# EAGLE board SCK_DATA_BOARD_2.2 (EAGLE 9.6.2)
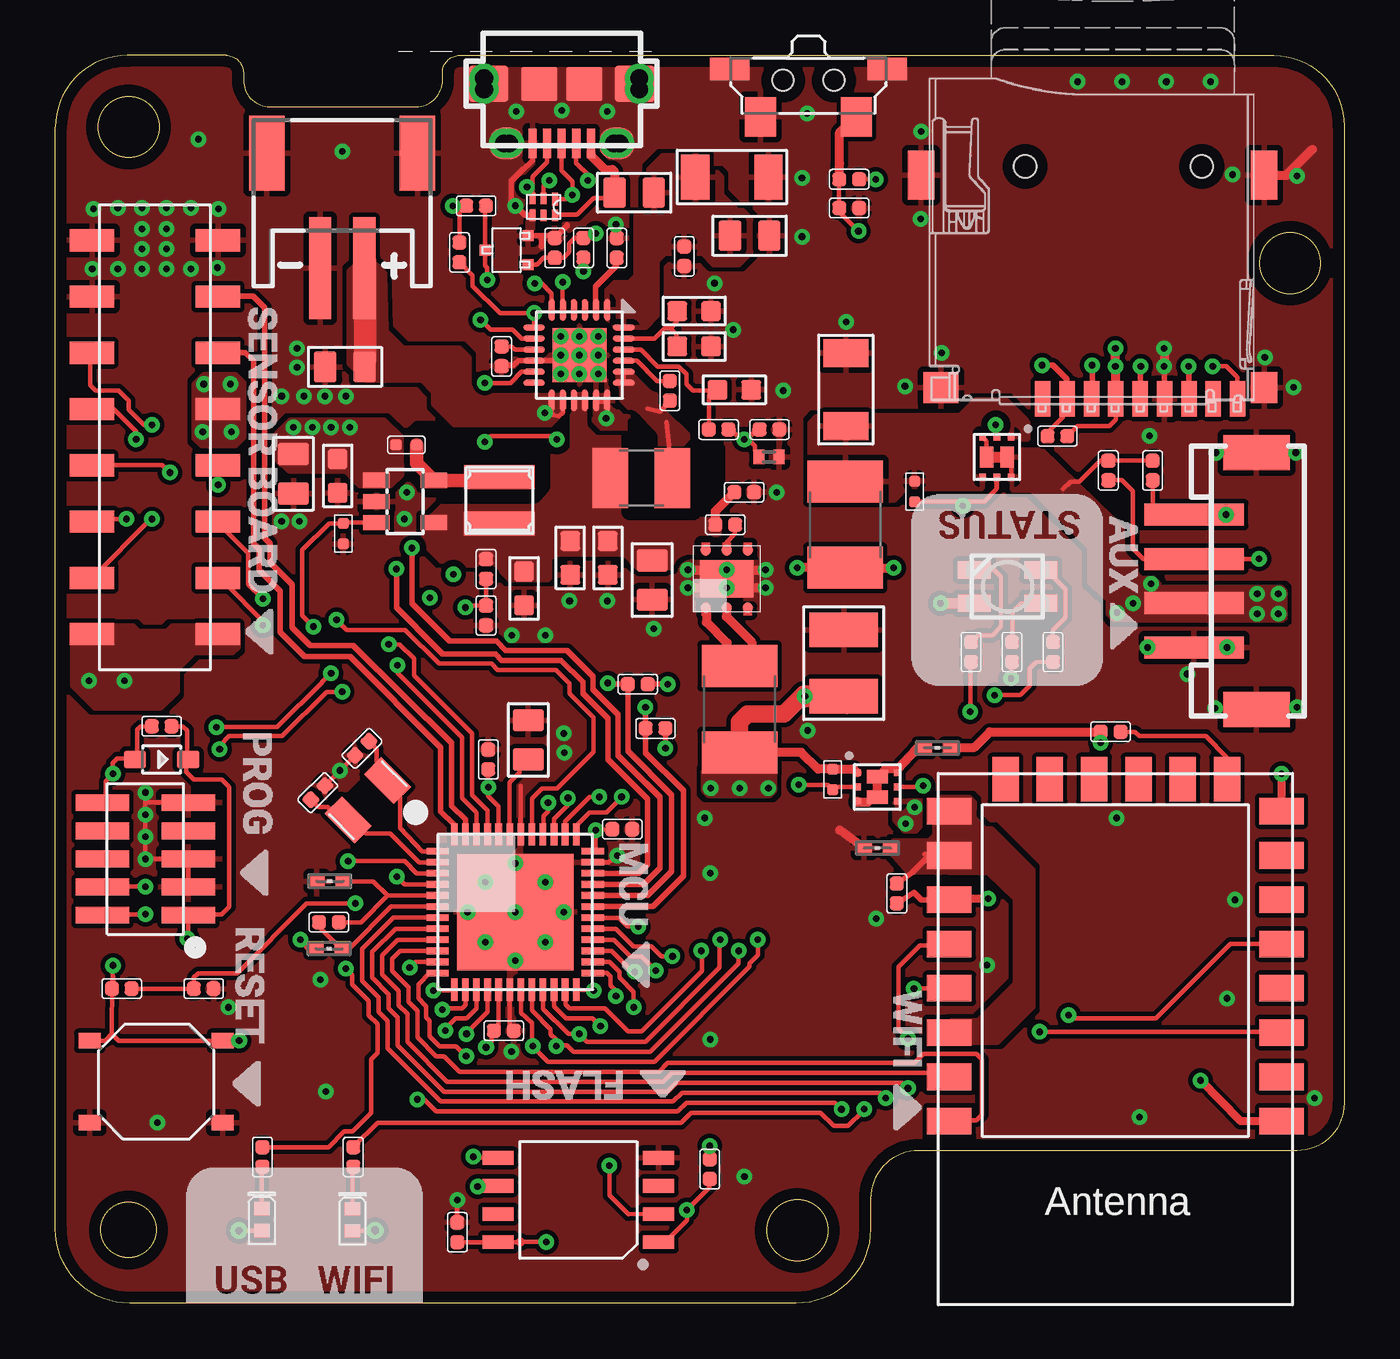
[diagram p3: board, top side]
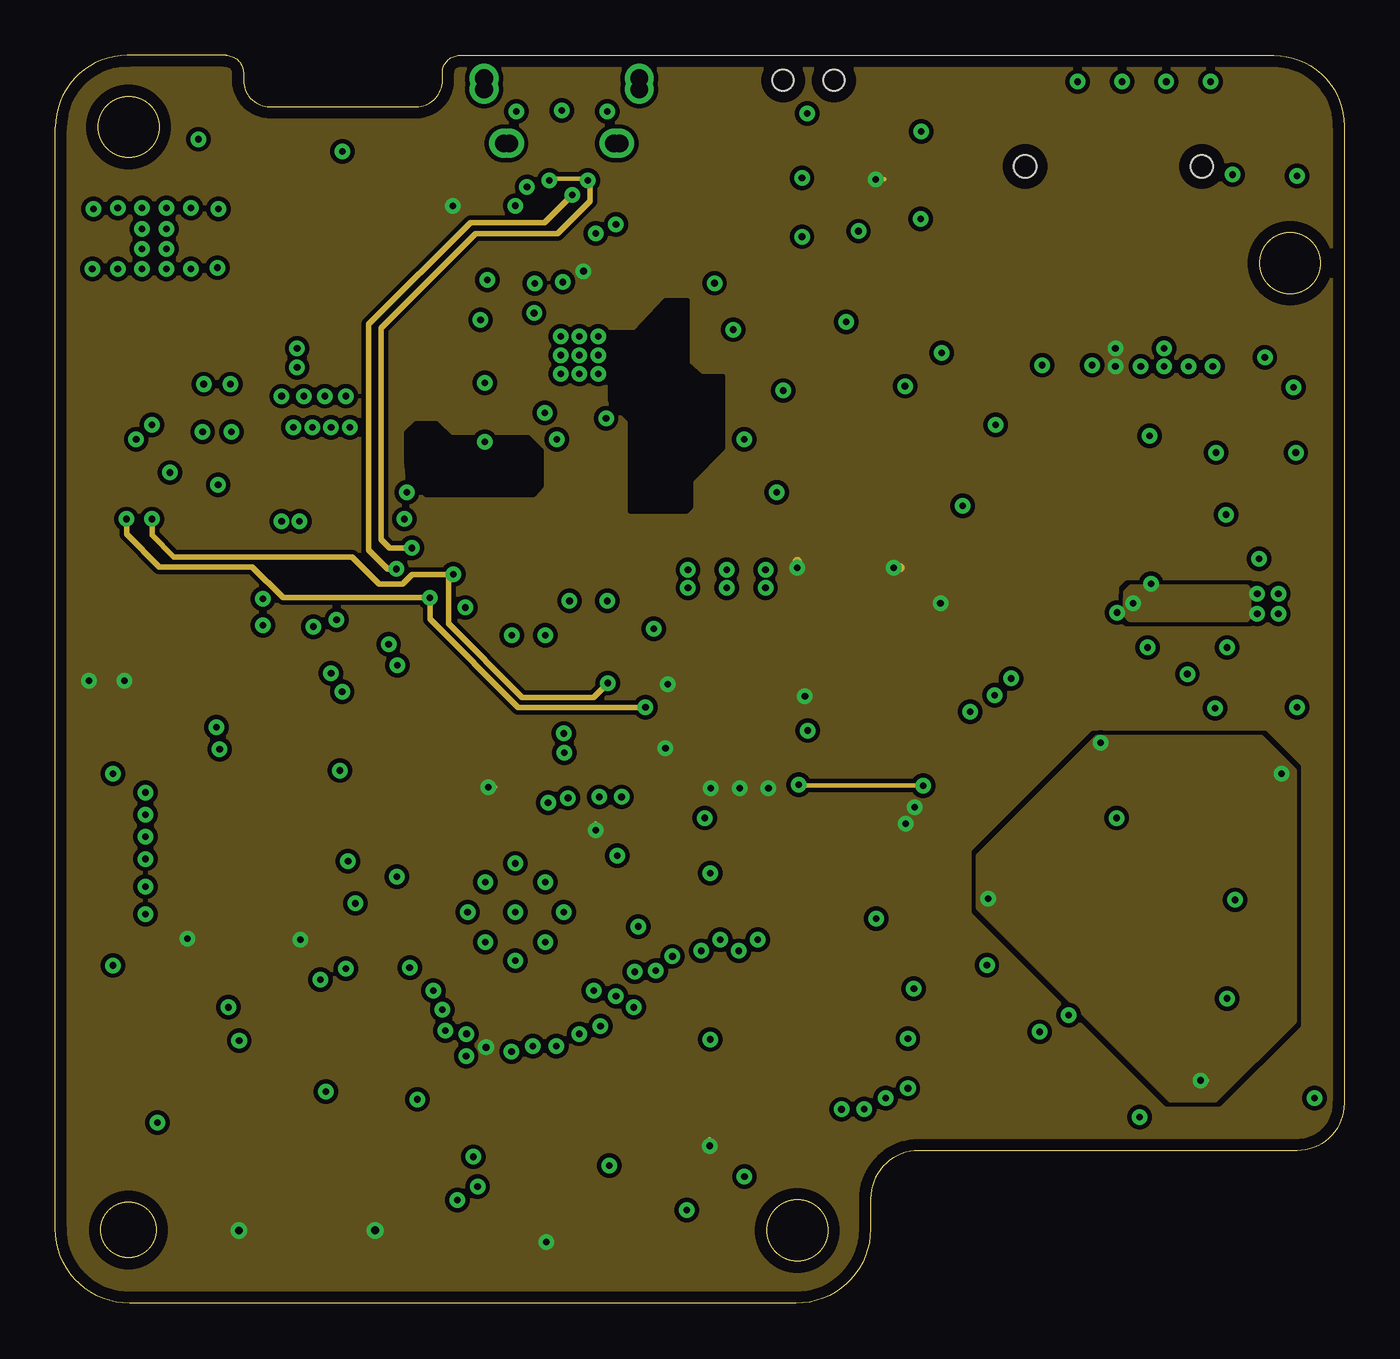
[diagram p4: board, inner layer VCC]
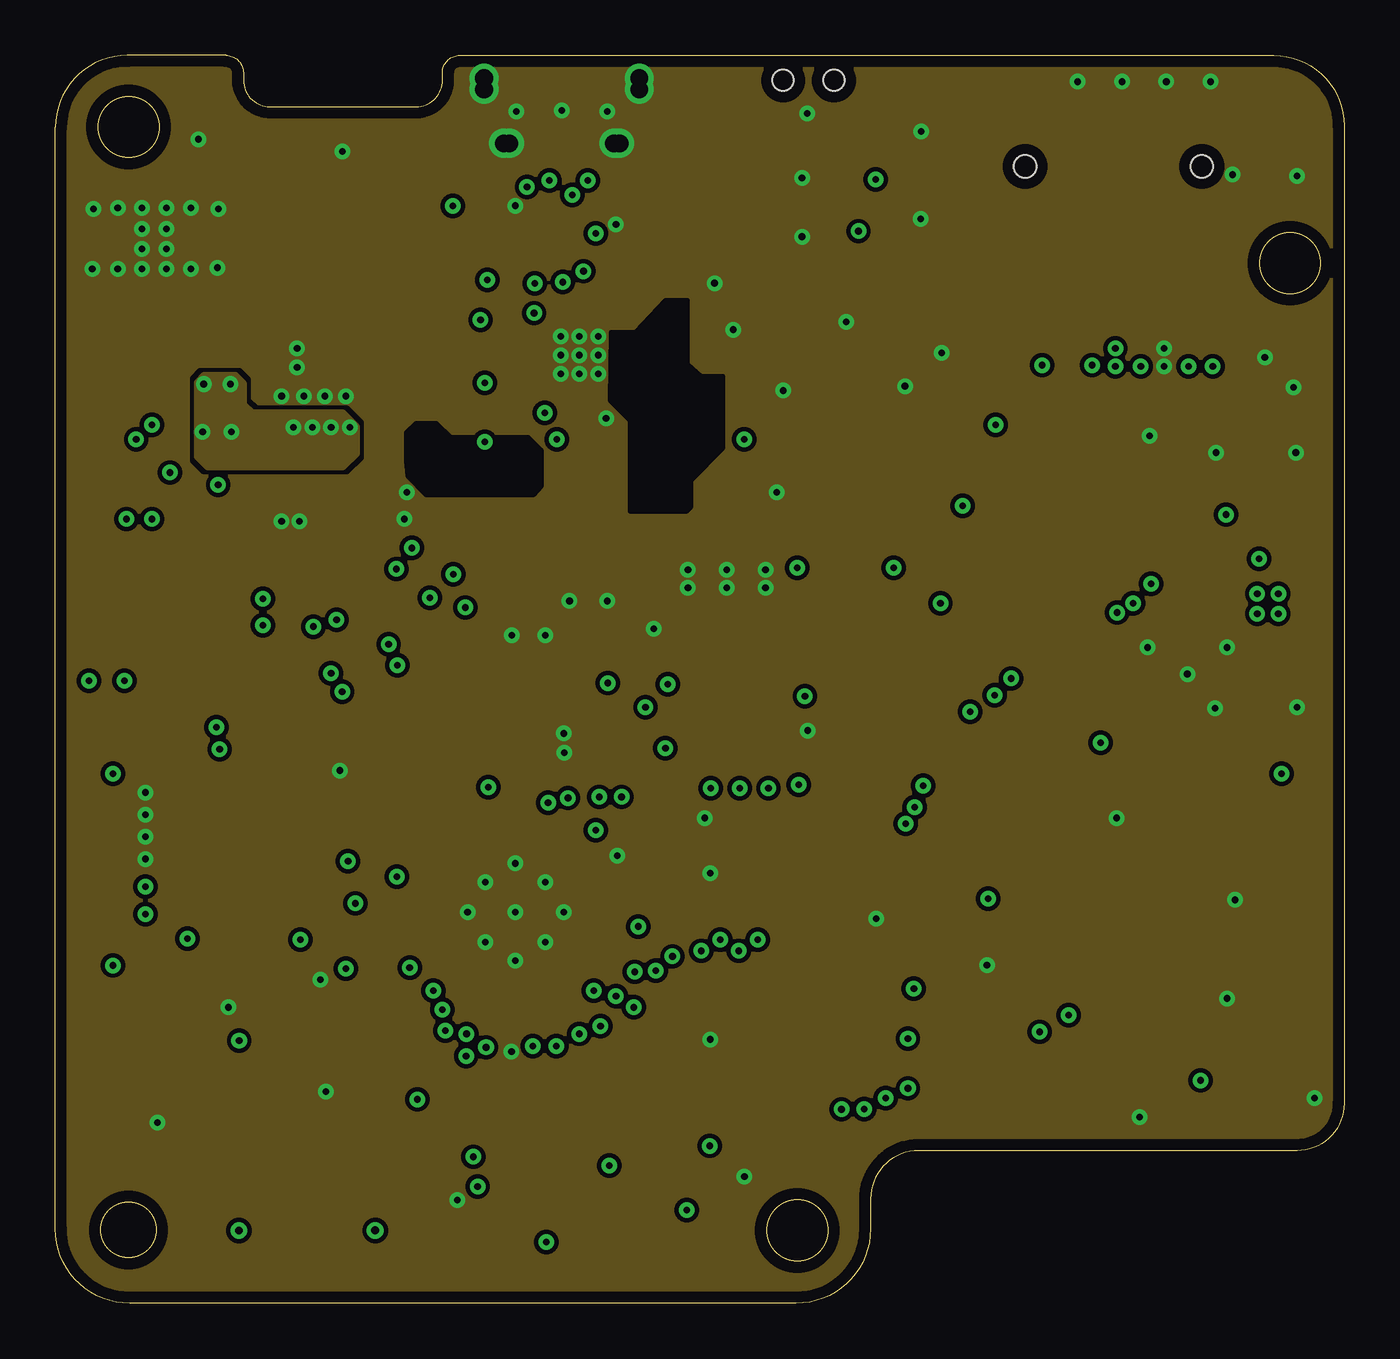
[diagram p5: board, inner layer GND]
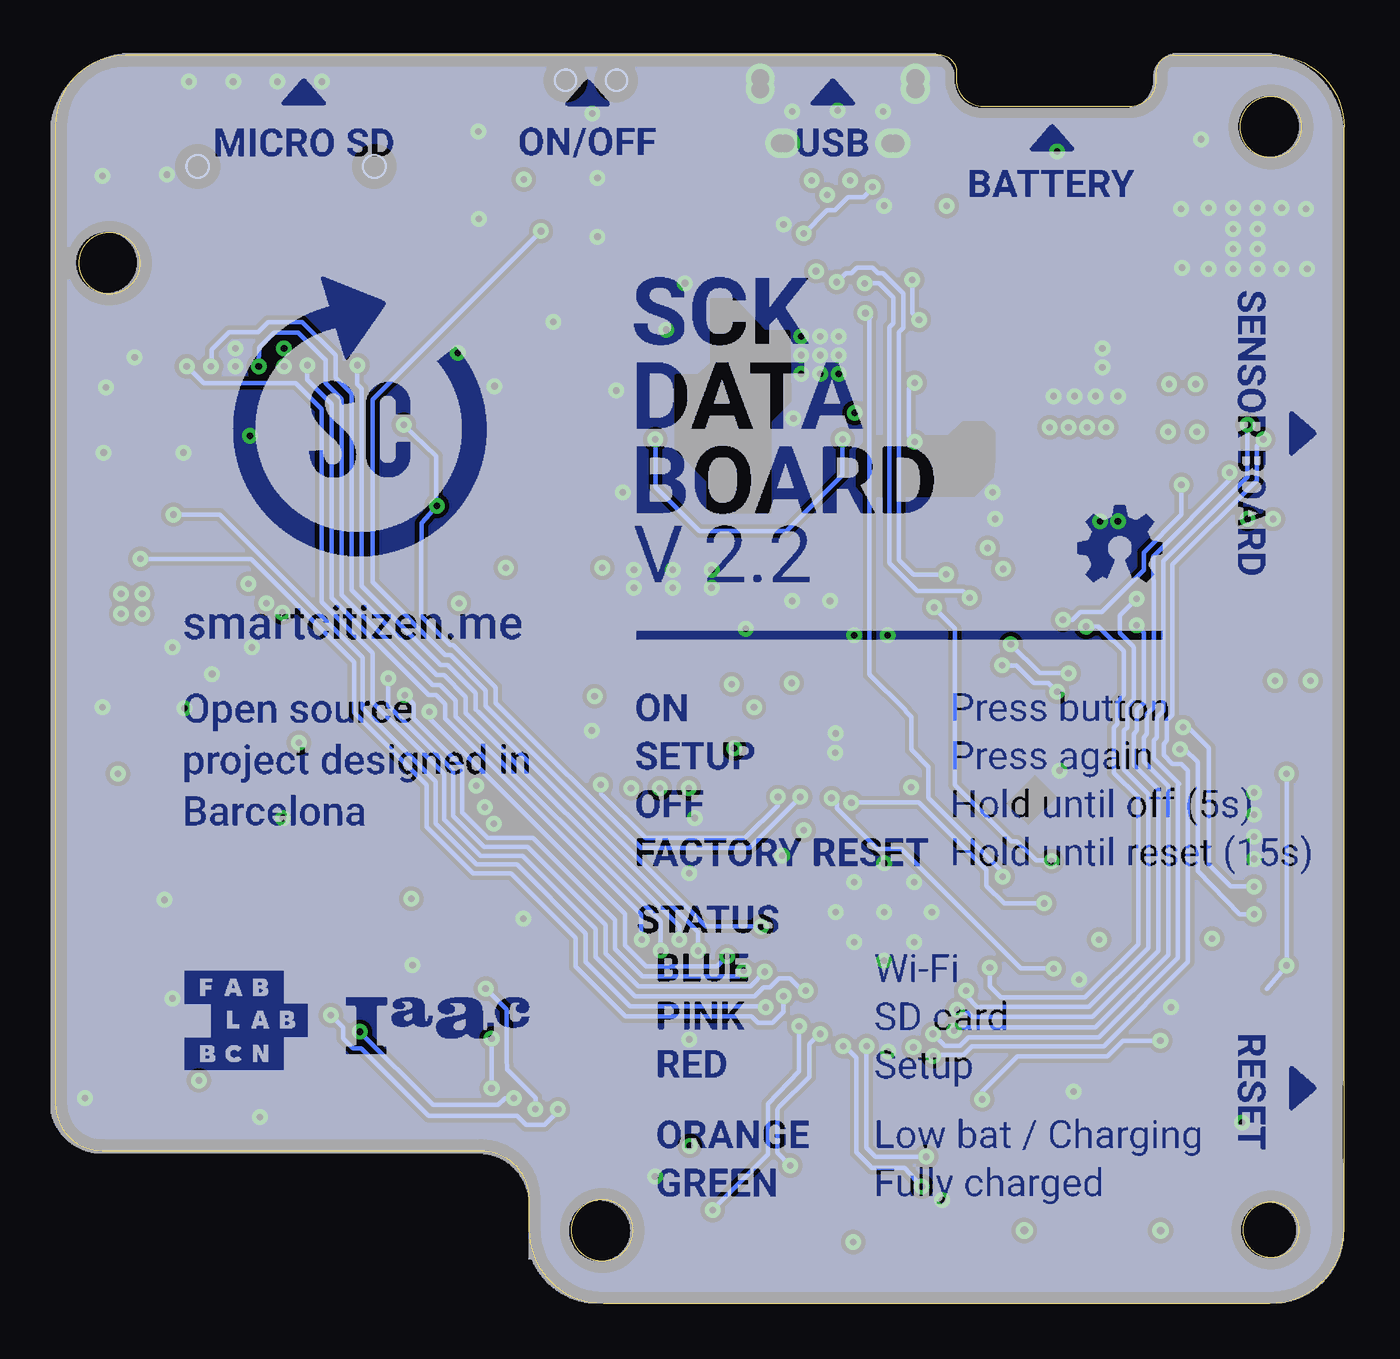
[diagram p6: board, bottom side, seen from below]

Size 58.2 x 56.36 mm. Coordinates in mm from the lower left corner, seen from the top.
Outline: 8.49,55.57 8.49,55.23 arc90 9.68,54.04 16.3,54.04 arc90 17.48,55.22 17.48,55.58 arc-90 18.26,56.36 55.03,56.36 arc-90 58.2,53.19 58.2,9.02 arc-90 56.07,6.89 38.99,6.89 arc90 36.81,4.72 36.81,3.36 arc-90 33.45,0 3.36,0 arc-90 0,3.36 0,53.1 arc-90 3.25,56.36 7.71,56.36 arc-90 8.49,55.57
Outline: circle at 33.5,3.29 radius 1.38
Outline: circle at 55.76,46.98 radius 1.38
Outline: circle at 3.3,53.12 radius 1.38
Outline: circle at 3.3,3.31 radius 1.25
Copper layers (1*2*3*16): Top 0.035mm / dielectric 0.2mm / VCC 0.035mm / dielectric 0.2mm / GND 0.035mm / dielectric 0.2mm / Bottom 0.035mm
Design rules "default *": minimum track width 0.2mm, minimum drill 0.3mm, track to track 0.2mm, track to pad 0.2mm, pad to pad 0.2mm, via to via 0.2mm, smd to smd 0mil, copper to edge 20mil, drill to drill 0.5mm, minimum pad ring 10mil, minimum via ring 0.2mm, stop-mask expansion 0.05mm, vias tented up to drill 24mil, thermal gap 10mil
Net classes: 2 gnd: width 0.254 mm, drill 0.254 mm, clearance 0.178 mm; 3 usbvcc: width 0.203 mm, drill 0.406 mm, clearance 0.178 mm; 4 USBpair: width 0.254 mm, drill 0.406 mm, clearance 0.406 mm
tRestrict: area 15.8,36.5 to 21.9,39.8; area 25.9,35.8 to 30.1,39.9
bRestrict: area 15.8,36.5 to 21.9,39.8; area 25.1,35.8 to 30.1,45.3

## Footprints (pad centres in the part's own frame; a part is rotated, then mirrored left to right if it is on the bottom)
JSTPH2_BATT = smd 1 x 4.6: 1 -1,-3.7; 2 1,-3.7 | smd 1.6 x 3.4: NC1 -3.4,1.5; NC2 3.4,1.5
C0402 = smd 0.635 x 0.635: 1 0,0.445; 2 0,-0.445
C1206 = smd 1.27 x 2.032: 1 -1.651,0; 2 1.651,0
C0805 = smd 1.397 x 1.016: 1 0,0.889; 2 0,-0.889
C1210 = smd 1.55 x 3.1: 1 -1.5,0; 2 1.5,0
C0603 = smd 0.889 x 0.889: 1 0,0.762; 2 0,-0.762
C0402' = smd 0.5 x 0.5: 1 0,0.463; 2 0,-0.463
PINHD_2X8_SMD_FEMALE_UNHOLED = smd 1 x 2: 1 -8.89,-2.84; 2 -8.89,2.845; 3 -6.35,-2.845; 4 -6.35,2.845; 5 -3.81,-2.84; 6 -3.81,2.85; 7 -1.27,-2.845; 8 -1.27,2.845; 9 1.27,-2.845; 10 1.275,2.845; 11 3.81,-2.84; 12 3.81,2.845; 13 6.35,-2.84; 14 6.35,2.845; 15 8.89,-2.845; 16 8.89,2.845
SOD-323 = smd 1 x 0.8: + -1.2,0; - 1.2,0
L1812 = smd 1.9 x 3.4: 1 -1.95,0; 2 1.95,0
SOT-23-5 = smd 0.69 x 1.2: 1 -0.95,-1.3; 2 0,-1.3; 3 0.95,-1.3; 4 0.95,1.3; 5 -0.95,1.3
24-PIN_VQFN_THPAD = smd 1 x 0.28: 1 -2.05,1.25; 2 -2.05,0.75; 3 -2.05,0.25; 4 -2.05,-0.25; 5 -2.05,-0.75; 6 -2.05,-1.25; 13 2.05,-1.25; 14 2.05,-0.75; 15 2.05,-0.25; 16 2.05,0.25; 17 2.05,0.75; 18 2.05,1.25 | smd 0.28 x 1: 7 -1.25,-2.05; 8 -0.75,-2.05; 9 -0.25,-2.05; 10 0.25,-2.05; 11 0.75,-2.05; 12 1.25,-2.05; 19 1.25,2; 20 0.75,2; 21 0.25,2; 22 -0.25,2; 23 -0.75,2; 24 -1.25,2 | smd 2.45 x 2.45: 25 0,0
DFN6_3X3MM = smd 0.45 x 0.5: 1 -0.95,-1.3; 2 0,-1.3; 3 0.95,-1.3; 4 0.95,1.3; 5 0,1.3; 6 -0.95,1.3 | smd 2.45 x 1.7: 7 0,0
HANGAR_ESP12-E = smd 2 x 1.2: 1 0.5,15.74; 2 0.5,13.74; 3 0.5,11.74; 4 0.5,9.74; 5 0.5,7.74; 6 0.5,5.74; 7 0.5,3.74; 8 0.5,1.74; 15 15.5,1.74; 16 15.5,3.74; 17 15.5,5.74; 18 15.5,7.74; 19 15.5,9.74; 20 15.5,11.74; 21 15.5,13.74; 22 15.5,15.74 | smd 1.2 x 2: 9 2.96,0.3; 10 4.96,0.3; 11 6.96,0.3; 12 8.96,0.3; 13 10.96,0.3; 14 12.96,0.3
QFN48-7X7 = smd 1 x 0.3: 1 -3.5,2.75; 2 -3.5,2.25; 3 -3.5,1.75; 4 -3.5,1.25; 5 -3.5,0.75; 6 -3.5,0.25; 7 -3.5,-0.25; 8 -3.5,-0.75; 9 -3.5,-1.25; 10 -3.5,-1.75; 11 -3.5,-2.25; 12 -3.5,-2.75; 25 3.5,-2.75; 26 3.5,-2.25; 27 3.5,-1.75; 28 3.5,-1.25; 29 3.5,-0.75; 30 3.5,-0.25; 31 3.5,0.25; 32 3.5,0.75; 33 3.5,1.25; 34 3.5,1.75; 35 3.5,2.25; 36 3.5,2.75 | smd 0.3 x 1: 13 -2.75,-3.5; 14 -2.25,-3.5; 15 -1.75,-3.5; 16 -1.25,-3.5; 17 -0.75,-3.5; 18 -0.25,-3.5; 19 0.25,-3.5; 20 0.75,-3.5; 21 1.25,-3.5; 22 1.75,-3.5; 23 2.25,-3.5; 24 2.75,-3.5; 37 2.75,3.5; 38 2.25,3.5; 39 1.75,3.5; 40 1.25,3.5; 41 0.75,3.5; 42 0.25,3.5; 43 -0.25,3.5; 44 -0.75,3.5; 45 -1.25,3.5; 46 -1.75,3.5; 47 -2.25,3.5; 48 -2.75,3.5 | smd 5.25 x 5.25: TP 0,0
SOIC_8-208MILS = smd 0.62 x 1.4: 1 -1.905,-3.823; 2 -0.635,-3.823; 3 0.635,-3.823; 4 1.905,-3.823; 5 1.905,3.423; 6 0.635,3.423; 7 -0.635,3.423; 8 -1.905,3.423
L0805 = smd 1.016 x 1.397: 1 -0.889,0; 2 0.889,0
HANGAR_C1210 = smd 1.6 x 2.7: 1 -1.4,0; 2 1.4,0
0402 = smd 0.7 x 0.6: 1 -0.6,0; 2 0.6,0
IND_BOURNS_SRN3015TA_3X3_SMD = smd 1.1 x 3.2: P$1 -1.05,0; P$2 1.05,0
HANGAR_P-LCC-4 = smd 0.8 x 1.5: 1 -0.75,-1.5; 2 -0.75,1.5; 3 0.75,1.5; 4 0.75,-1.5
CHIPLED_0402_YELLOW = smd 0.6 x 0.7: A 0.5,0; K -0.5,0
CHIPLED_0402_BLUE = smd 0.6 x 0.7: A 0.5,0; K -0.5,0
SW4-SMD-7.0X3.5X3.5MM-90D = smd 1.397 x 1.778: 1 -2.159,1.651; 2 2.159,1.651 | smd 1.778 x 1.016: S1 -3.556,-0.508; S2 3.556,-0.508 | hole 0.95: -1.15,0; 1.15,0
SW4-SMD-5.2X5.2X1.5MM = smd 1 x 0.7: 1 -3,1.85; 2 3,1.85; 3 -3,-1.85; 4 3,-1.85
POWERPAK-SC70-6L = smd 0.3 x 0.325: 1 -0.65,-0.912; 2 0,-0.912; 3 0.65,-0.912; 4 0.65,0.912; 5 0,0.912; 6 -0.65,0.912 | smd 0.613 x 0.95: TP1 -0.467,0; TP2 0.467,0
NMOS_UMT3 = smd 0.5 x 0.5: 1 0.65,-2.05; 2 -0.65,-2.05; 3 0,-0.1
HANGAR_R0402 = smd 0.5 x 0.65: 1 -0.45,0; 2 0.45,0
R0402 = smd 0.635 x 0.635: 1 0,0.445; 2 0,-0.445
R0402' = smd 0.5 x 0.5: 1 0,0.463; 2 0,-0.463
TF-01 = smd 0.7 x 1.6: 1 2.25,10.5; 2 1.15,10.5; 3 0.05,10.5; 4 -1.05,10.5; 5 -2.15,10.5; 6 -3.25,10.5; 7 -4.35,10.5; 8 -5.45,10.5; CD -6.55,10.5 | smd 1.2 x 1.4: 9 -7.75,10 | smd 1.2 x 2.2: 10 -7.75,0.4; 11 7.75,0.4 | smd 1.6 x 1.4: 12 6.85,10 | hole 1: -4.93,0; 3.05,0
2X05_SMD_1.27MM = smd 0.76 x 2.4: 1 -2.54,-1.94; 2 -2.54,1.94; 3 -1.27,-1.94; 4 -1.27,1.94; 5 0,-1.94; 6 0,1.94; 7 1.27,-1.94; 8 1.27,1.94; 9 2.54,-1.94; 10 2.54,1.94
DRY6 = smd 0.559 x 0.305: 1 -0.356,0.508 | smd 0.508 x 0.305: 2 -0.381,0; 3 -0.381,-0.508; 4 0.381,-0.508; 5 0.381,0; 6 0.381,0.508
CON2_USB_MICRO_B_AT = smd 0.406 x 1.346: D+ 0,2.692; D- -0.66,2.692; GND 1.321,2.692; ID 0.66,2.692; VBUS -1.321,2.692 | drill 0.8 pad 1.27: P$1 -2.616,2.692 | drill 0.8 pad 1.245: P$2 -2.362,2.692; P$7 2.362,2.692; P$8 2.616,2.692 | drill 0.8 pad 1.143: P$3 -3.505,-0.254; P$4 -3.505,0.254; P$5 3.505,0.254; P$6 3.505,-0.254 | smd 1.778 x 1.651: S1 -3.302,0; S2 3.302,0 | smd 1.524 x 1.41: S3 -2.489,2.692; S4 2.489,2.692 | smd 1.626 x 1.524: S5 -1.016,0; S6 1.016,0
CONNECTOR-NEW_HW4-SMD-2.0 = smd 1 x 4.5: 1 -3,0.3; 2 -1,0.3; 3 1,0.3; 4 3,0.3 | smd 1.6 x 3: SS1 -5.8,3.123; SS2 5.8,3.123
CRISTALLI_RESONATOR_EPSON_FC_145 = smd 1.1 x 1.9: P$1 -1.25,0; P$2 1.25,0

## Placement (x,y rotation side)
BAT  JST_PH_2PIN_MT_BATT  [JSTPH2_BATT]  12.95,50.44 0 top
C1  100nf  [C0402]  38,18.51 0 top
C2  100nf  [C0402]  18.15,3.21 0 top
C3  10nf  [C0402]  6.7,14.21 270 top
C4  100nf  [C0402]  28.4,47.28 180 top
C5  10uf  [C1206]  30.55,50.86 180 top
C6  1uf  [C0805]  31.35,48.21 270 top
C7  47uf  [C0805]  10.75,37.46 180 top
C8  10uf  [C1206]  35.7,41.26 270 top
C9  47uf  [C1210]  35.6,28.91 270 top
C10  100nf  [C0402]  31.1,36.63 270 top
C11  1uf  [C0805]  26.95,32.66 180 top
C12  4.7uf  [C0603]  28.85,44.81 270 top
C13  4.7uf  [C0603]  28.85,43.21 270 top
C14  47nf  [C0402]  27.75,41.21 0 top
C15  10uf  [C0603]  23.25,33.66 180 top
C16  10uf  [C0603]  24.95,33.66 180 top
C17  4.7uf  [C0603]  30.66,41.25 270 top
C18  4.7uf  [C0603]  21.17,32.28 180 top
C19  22pf  [C0402]  13.85,25.06 135 top
C20  22pf  [C0402]  11.85,23.06 315 top
C21  2.2nf  [C0402']  15.85,38.76 90 top
C22  100nf  [C0402]  12.35,17.21 270 top
C23  100nf  [C0402]  20.25,12.31 270 top
C24  100nf  [C0402]  19.55,24.56 0 top
C25  100nf  [C0402]  25.6,21.41 270 top
C26  1uf  [C0805]  21.36,25.44 0 top
C27  10uf  [C0603]  12.75,37.36 180 top
C28  1uf  [C0805]  13.08,42.29 90 top
C29  100nf  [C0402]  35.85,49.46 270 top
CONN_DATA  [PINHD_2X8_SMD_FEMALE_UNHOLED]  4.5,39.11 90 top
D1  30V-0.5A  [SOD-323]  4.8,24.56 0 top
F1  MF-MSMF075-2 750mA  [L1812]  35.67,35.17 270 top
F2  MF-MSMF150/12 1500mA  [L1812]  30.9,26.83 90 top
IC1  ETA1036-50S2F-T-SOT23-5  [SOT-23-5]  15.8,36.21 270 top
IC2  BQ24259_VQFN(24)  [24-PIN_VQFN_THPAD]  23.67,42.82 270 top
IC3  LD39200  [DFN6_3X3MM]  30.32,32.72 0 top
IC4  HANGAR_ESP-12-E  [HANGAR_ESP12-E]  55.87,23.97 180 top
IC5  SAMD21G18A-MUT  [QFN48-7X7]  20.77,17.67 0 top
IC6  S25FL064L  [SOIC_8-208MILS]  23.42,4.67 90 top
L1  470R-2A  [L0805]  26.14,50.16 0 top
L2  1uH  [HANGAR_C1210]  26.47,37.27 180 top
L3  MPZ1005S121C  [0402]  39.83,25.08 180 top
L4  MPZ1005S121C  [0402]  37.12,20.56 180 top
L5  MPZ1005S121C  [0402]  12.36,16.02 0 top
L6  MPZ1005S121C  [0402]  12.4,19.06 0 top
L7  6.8uH  [IND_BOURNS_SRN3015TA_3X3_SMD]  20.05,36.26 90 top
LED1  LED_RGB_CAASMB-MTB1-0A3A  [HANGAR_P-LCC-4]  43,32.36 270 top
LED2  YELLOW-0402  [CHIPLED_0402_YELLOW]  9.33,3.78 270 top
LED3  BLUE-0402  [CHIPLED_0402_BLUE]  13.42,3.77 270 top
P1  TS-1188E  [SW4-SMD-7.0X3.5X3.5MM-90D]  34.01,55.23 180 top
P2  SKQGADE010  [SW4-SMD-5.2X5.2X1.5MM]  4.55,10.01 0 top
Q1  PMOS  [POWERPAK-SC70-6L]  37.12,23.32 270 top
Q2  NMOS  [NMOS_UMT3]  19.3,47.56 90 top
Q3  PMOS  [POWERPAK-SC70-6L]  42.52,38.22 180 top
R1  No BOM  [HANGAR_R0402]  32.22,38.22 180 top
R2  10K 1/16W  [R0402]  19.45,33.16 180 top
R3  10K 1/16W  [R0402]  47.65,25.81 270 top
R4  1K  [R0402]  13.45,6.61 0 top
R5  10K 1/16W  [R0402]  30.25,35.16 90 top
R6  100K 1/16W  [R0402]  25.35,47.66 0 top
R7  100K 1/16W  [R0402]  22.55,47.66 0 top
R8  100K 1/16W  [R0402]  19,49.56 270 top
R9  100K 1/16W  [R0402]  20.15,42.76 180 top
R10  47K  [R0402]  29.95,39.46 270 top
R11  68K  [R0402]  32.25,39.46 270 top
R12  10K 1/16W  [R0402]  19.45,31.06 180 top
R13  10K 1/16W  [R0402]  27.1,25.96 90 top
R14  10K 1/16W  [R0402]  26.3,27.96 90 top
R15  330R  [R0402]  3,14.21 270 top
R16  10K 1/16W  [R0402]  4.8,26.06 90 top
R17  10K 1/16W  [R0402]  35.85,50.76 90 top
R18  1K  [R0402]  9.35,6.61 0 top
R19  1K  [R0402]  41.35,29.41 180 top
R20  1K  [R0402]  45.05,29.41 180 top
R21  1K  [R0402]  43.2,29.41 180 top
R22  10K 1/16W  [R0402]  49.55,37.61 180 top
R23  10K 1/16W  [R0402]  47.55,37.61 180 top
R24  10K 1/16W  [R0402]  29.55,6.06 180 top
R25  10K 1/16W  [R0402]  45.25,39.16 90 top
R26  10K 1/16W  [R0402]  23.85,47.66 0 top
R27  10K 1/16W  [R0402']  13,34.76 180 top
R28  10K 1/16W  [R0402']  35.1,23.66 180 top
R29  10K 1/16W  [R0402']  38.8,36.66 0 top
R30  10K 1/16W  [R0402]  18.25,47.46 180 top
SD1  SD_CARD_SOCKETTF-01  [TF-01]  46.84,51.34 180 top
SWD  20021121-00010C4LF  [2X05_SMD_1.27MM]  4.07,20.07 90 top
TVS1  TPD4S012_DRY_6  [DRY6]  22.05,49.51 270 top
USB  10118193-0001LF  [CON2_USB_MICRO_B_AT]  22.86,55.07 180 top
X1  1125S-SMT-4P  [CONNECTOR-NEW_HW4-SMD-2.0]  51.12,32.62 270 top
Y1  32,768Khz_SMD  [CRISTALLI_RESONATOR_EPSON_FC_145]  14.11,22.72 45 top

## Tracks (layer width: path | path; a pad name or v marks a point on that pad's centre or on a via)
!INT_CCS  (via drill 0.3)
  Top 0.2: IC5.13 17.8,14.14 17.09,14.14 v17.07,14.12 | 9.37,31.87 v9.37,31.82 8.72,32.47 8.72,33.88 7.34,35.26 CONN_DATA.5
  Bottom 0.2: v9.37,31.82 10.12,31.07 10.12,30.27 9.52,29.67 9.52,29.63 9.5,29.61 9.5,27.26 9.8,26.96 9.8,26.01 9.95,25.86 9.95,24.11 8.85,23.01 8.85,16.06 11.53,13.38 13.13,13.38 16.42,13.38 16.56,13.37 17.07,13.88 v17.07,14.12
!WAKE_CCS  (via drill 0.3)
  Top 0.2: CONN_DATA.7 v7.34,36.97 v7.35,36.96 | 21.55,21.2 IC5.41 21.52,22.8 21.98,23.26 22.65,23.26 24.29,24.9 24.29,26.46 23.22,27.53 23.22,27.99 22.6,28.61 19.97,28.61 19.69,28.89 17.32,28.89 15.79,30.41 15.19,30.41
  Top 0.203: v12.7,30.86 13.15,30.41 15.19,30.41 15.47,30.41
  Bottom 0.2: v7.35,36.96 7.35,35.61 9.05,33.91 9.05,33.11 10.15,32.01
  Bottom 0.203: v12.7,30.86 12.27,30.86 11.92,31.21 10.95,31.21 10.15,32.01
+5V  (via drill 0.3)
  Top 0.5: CONN_DATA.9
  other vias: 10.75,39.56 11.6,39.56 12.45,39.56 13.3,39.56 6.65,39.36 7.95,39.36 6.7,41.51 7.9,41.51
  pour Top (no thermals): 10.2,37.86 9.9,38.16 9.9,39.21 10.6,39.91 14.85,39.91 15.65,39.11 15.65,37.41 15.15,36.91 13.75,36.91 13.1,37.56 10.55,37.56 10.35,37.76
  pour GND: 6.35,41.61 6.7,41.96 8.15,41.96 8.55,41.56 8.55,40.61 8.9,40.26 13,40.26 13.65,39.61 13.65,38.36 13,37.71 6.85,37.71 6.35,38.21
  pour Top (no thermals): 6.3,41.56 6.7,41.96 8.15,41.96 8.55,41.56 8.55,39.36 8.55,39.11 8.15,38.71 6.6,38.71 6.25,39.06 6.25,41.51
AGND
  Top 0.2: 15,18.41 13.8,17.21 C22.1 | 15,18.41 IC5.5 | L6.2 14.35,19.06 15,18.41
  Top 0.25: IC5.5
AVCC
  Top 0.2: IC5.6 15.17,17.92 13.27,16.02 L5.2 12.89,16.02 11.95,16.96 11.95,17.27 C22.2
BTST
  Top 0.2: IC2.21 26.27,42.57 27.18,41.66 C14.1
CD_MMC  (via drill 0.3)
  Top 0.2: SD1.CD 53.39,40.6 53.37,41.82 52.87,42.32 v52.27,42.32 | v24.32,14.12 23.99,14.14 IC5.24
  Bottom 0.2: v24.32,14.12 24.47,14.12 24.67,14.32 25.02,14.67 25.52,14.67 25.92,14.27 26.22,14.27 26.62,13.87 32.03,13.87 33.8,15.64 33.8,16.91 37.1,20.21 39,20.21 40.64,21.85 40.64,23.9 43.87,27.13 43.87,29.37 46.17,31.67 46.17,40.38 47.35,41.56 51.51,41.56 v52.27,42.32
CH_PD  (via drill 0.3)
  Top 0.2: IC5.7 15.27,17.42 13.85,16 13.85,14.56 14.6,13.81 14.6,13.16 15,12.76 15,11.51 17.4,9.11 27.9,9.11 28.3,9.51 37.25,9.51 v37.5,9.26 | v44.45,12.26 55.34,12.26 IC4.3
  Bottom 0.2: v37.5,9.26 37.9,9.26 38.2,8.96 41.15,8.96 v44.45,12.26
CONTROL  (via drill 0.3)
  Top 0.2: IC5.30 25.45,17.41 25.84,17.02 v26.32,17.02 | 35.42,51.47 35.39,51.39 | R17.1 35.39,50.74 35.39,49.48 C29.2 35.41,49.28 v36.27,48.42
  Top 0.4: 35.39,51.39 35.39,50.78 R17.1 | 35.42,51.47 35.42,52.87
  Top 0.406: 35.42,52.87 36.13,53.58 P1.1
  Bottom 0.2: v26.32,17.02 28.82,17.02 38.77,26.97 38.77,27.68 40.35,29.27 40.59,29.27 43.87,32.58 43.87,33.42 43.87,40.82 v36.27,48.42
CS_FLASH  (via drill 0.3)
  Top 0.2: IC5.22 22.52,13.42 23.07,12.87 24.27,12.87 v24.62,12.52 | IC6.1 27.54,2.77 28.52,3.74 v28.52,4.22 29.55,5.25 R24.1
  Bottom 0.2: v24.62,12.52 24.62,10.47 26.02,9.02 26.02,6.72 v28.52,4.22
CS_MMC  (via drill 0.3)
  Top 0.2: IC5.23 23.03,14.16 23.03,13.51 23.22,13.32 24.77,13.32 24.82,13.32 25.85,12.28 26.47,12.28 29.2,15.01 29.2,15.89 v29.17,15.92 | R25.1 44.81,39.32 45.5,40.01 45.5,40.65 SD1.2 45.67,40.87
  Top 0.25: 45.67,40.87 45.67,41.74 45.04,42.37 v44.57,42.37
  Bottom 0.2: v44.57,42.37 44.57,41.52 44.37,41.32 44.37,32.39 40.8,28.82 40.48,28.82 39.22,27.55 39.22,26.82 39.11,26.72 29.17,16.78 v29.17,15.92
FREE2  (via drill 0.3)
  Top 0.2: IC5.14 18.52,13.47 18.37,13.32 17.52,13.32 v17.47,13.27 | 7.7,32.51 9.37,30.82 v9.37,30.62 9.19,30.44 | 7.7,32.51 7.44,32.77 | CONN_DATA.3 7.45,32.76 7.7,32.51
  Bottom 0.2: v17.47,13.27 17.32,13.12 16.97,13.12 16.78,12.93 11.38,12.93 8.4,15.91 8.4,23.21 9.5,24.31 9.5,25.71 9.35,25.86 9.35,26.81 9.05,27.11 9.05,30.3 v9.37,30.62 9.06,30.31
GND  (via drill 0.3)
  Top 0.2: 20.77,19.77 v20.77,19.87 | v4.07,23.07 4.07,22.57 | 4.07,22.57 v4.07,22.07 v4.07,21.07 v4.07,20.07 SWD.5 SWD.3 | SWD.9 4.11,22.61 4.07,22.57 | 25.44,20.24 v25.37,20.22 24.97,19.92 IC5.35 | IC5.42 21.02,23.37 | 39.47,41.77 39.89,41.34 SD1.12 | IC5.18 20.52,12.49 C23.1 | C2.1 v18.15,4.66 | C20.1 v12.85,24.06 C19.1 | 21.56,52.21 21.55,52.22
  Top 0.25: SD1.9 54.79,41.69 | SD1.6 50.09,42.3 v50.07,42.32 | TVS1.4 21.22,49.13 20.59,49.76 20.59,50.68 21.11,51.21 21.1,51.16 21.55,51.61 21.55,52.22 | 26.73,6.56 IC6.4 | v22.82,42.82 22.57,42.57 IC2.10 20.91,42.57 20.7,42.36 20.2,42.36 R9.1 | Q2.1 21.9,48.21 21.95,48.16 | 21.95,48.16 21.95,47.71 | R7.1 23.1,48.66 23.1,48.71 | 21.95,48.16 22,48.21 22.55,48.21 R7.1
  Top 0.3: IC2.17 IC2.18
  Top 0.4: v50.07,43.12 v50.07,42.32 | SD1.10 55.59,50.94 56.77,52.12 | L4.2 35.42,21.37 | v28.57,33.12 v30.32,33.12 v32.07,33.12 | v28.57,32.32 v30.32,32.32 v32.07,32.32
  Bottom 0.2: v20.6,11.36 20.55,11.56 | v18.15,4.66 18.15,4.51 | v12.85,24.06 13,23.91
  other vias: 19.42,19.02 19.42,16.32 20.77,17.67 22.97,17.67 1.72,49.42 12.97,52.02 33.97,25.87 20.77,15.47 22.12,16.32 18.62,17.67 47.92,21.92 48.97,8.42 53.27,18.22 52.92,13.77 31.12,5.72 12.22,9.57 52.37,26.87 29.77,46.07 20.82,53.82 39.09,52.93 32.87,41.22 55.92,41.37 54.62,42.72 7.37,49.42 53.17,50.97 56.07,50.92 35.72,44.32 56.07,26.92 24.92,31.72 23.67,42.82 7.82,13.37 20.77,49.57 1.67,46.72 22.87,53.87 24.87,39.97 30.62,43.97 22.12,19.02 22.82,43.67 24.52,41.97 23.67,41.97 24.52,43.67 23.67,43.67 24.52,42.82 22.82,41.97 10.92,42.27 10.92,43.12 4.62,8.17 33.72,50.82 33.95,53.74 46.17,55.17 24.92,53.82 29.57,11.92 6.47,52.57 52.17,55.17 42.07,15.27 50.17,55.17 33.72,48.17 48.17,55.17 29.32,21.92 27.02,30.47 49.32,29.62 11.97,14.62 51.12,28.42 52.42,38.42 56.02,38.42 39.07,48.97 49.42,39.17 38.37,41.42 40.02,42.92 7.32,46.77 52.92,29.62 56.87,9.27 37.07,17.37 23.22,31.72 29.57,19.42 32.57,36.62 25.32,48.72 20.62,30.17 22.12,30.17 10.22,35.32 11.02,35.32 15.87,36.62 15.77,35.42 10.22,40.97 11.22,40.97 12.17,40.97 13.12,40.97 2.82,49.47 3.92,49.47 5.02,49.47 6.12,49.47 2.82,46.72 3.92,46.72 5.02,46.72 6.12,46.72 3.92,48.52 5.02,48.52 3.92,47.62 5.02,47.62 22.96,25.73 22.98,24.87
  pour Top (no thermals): 24.42,41.02 24.42,40.52 24.37,40.47 24.37,39.83 24.65,39.54 25.11,39.54 25.33,39.75 25.34,40.2 24.97,40.57 24.97,41.02
  pour Bottom (no thermals): -0.43,56.57 -0.43,-0.53 58.17,-0.53 58.32,56.37
  pour Top (rank 2): -0.43,56.57 -0.43,-0.53 58.17,-0.53 58.22,56.37
  pour GND (rank 2, no thermals): -0.33,56.57 -0.33,-0.53 58.27,-0.53 58.32,56.52
  pour Top (no thermals): 28.67,32.02 28.77,31.97 31.07,31.97 31.17,31.87 31.17,31.62 31.32,31.47 31.67,31.47 32.02,31.82 32.02,33.47 28.97,33.47 28.67,33.42 28.62,32.07
  pour Top (no thermals): 25.22,20.62 25.07,20.47 25.07,19.87 26.32,19.87 26.32,20.62
GND_WIFI
  Top 0.25: 39.26,20.26 39.52,20.27 | 39.52,20.27 40.33,20.27 IC4.16 | C1.1 38.7,19.46 39.52,20.27
  Top 0.35: IC4.15
  pour Top (no thermals): 41.27,22.87 40,22.86 39.7,22.56 39.7,21.16 39.45,20.91 37.85,20.91 37.71,20.77 37.71,20.71 37.71,20.36 38.49,19.47 42.12,19.42 43.32,18.27 43.32,14.44 41.65,12.77 40.47,12.77 40.22,12.52 40.22,11.97 40.42,11.77 42.55,11.77 44.16,13.39 44.16,19.57 42.29,21.45 41.92,21.47 41.51,21.93 41.52,22.62
GPIO0  (via drill 0.3)
  Top 0.2: IC5.8 15.36,16.92 14.3,15.86 14.3,14.71 15.05,13.96 15.05,13.31 15.45,12.91 15.45,11.66 17.55,9.56 27.65,9.56 28.05,9.96 38.25,9.96 v38.5,9.71 | IC4.18 40.3,16.16 39.05,16.16 38.07,15.18 38.07,12.39 v38.5,11.96
  Bottom 0.2: v38.5,9.71 v38.5,11.96 | v38.5,11.96 38.55,12.01 38.55,11.96 v38.5,11.96
I2S_FS  (via drill 0.3)
  Top 0.2: v18.57,12.17 18.57,12.22 19.52,13.17 IC5.16 | v4.37,39.67 4.02,39.67 3.32,40.37 3.32,40.77 2.87,41.22 1.82,41.22 1.57,41.47 1.57,42.85 1.58,42.85 CONN_DATA.12
  Bottom 0.2: v18.57,12.17 18.02,11.62 17.36,11.62 16.97,12.02 11.08,12.02 7.5,15.6 7.5,23.41 7.45,23.46 8.6,24.61 8.6,25.41 8.45,25.56 8.45,26.46 8.17,26.74 8.17,33.52 4.37,37.32 v4.37,39.67 v4.36,39.67
I2S_SCK  (via drill 0.3)
  Top 0.2: IC5.15 19.02,13.32 18.57,12.87 18.07,12.87 17.62,12.42 v17.62,12.32 | v5.17,37.52 4.87,37.82 4.82,37.86 2.4,37.86 2.38,37.84 CONN_DATA.8
  Bottom 0.2: v17.62,12.32 17.47,12.47 12.83,12.47 12.83,12.46 11.22,12.46 7.95,15.74 7.95,23.36 9.05,24.46 9.05,25.56 8.9,25.71 8.9,26.61 8.6,26.91 8.6,32.66 8.62,32.68 8.62,33.73 5.18,37.17 v5.17,37.52
I2S_SD  (via drill 0.3)
  Top 0.2: CONN_DATA.10 2.62,40.39 3.65,39.36 v3.65,39.01 | IC5.12 16.91,14.92 16.4,14.41 16.4,13.76 16.75,13.41 16.75,12.91 16.9,12.76 16.9,12.06 17.35,11.61 18.1,11.61 v18.55,11.16
  Bottom 0.2: v3.65,39.01 3.95,38.71 3.95,37.16 7.75,33.36 7.75,26.56 8,26.31 8,25.41 8.15,25.26 8.15,24.76 7.75,24.36 7.35,24.36 7.05,24.06 7.05,15.41 10.85,11.61 16.8,11.61 17.2,11.21 18.35,11.21 18.35,11.26 18.45,11.26 v18.55,11.16
INT_CHG  (via drill 0.3)
  Top 0.2: IC2.7 v21.62,44.72 20.07,44.72 18.85,45.94 18.85,46.42 R30.1 | IC5.4 15.77,18.92 v15.42,19.27
  Bottom 0.2: 21.37,44.57 21.52,44.72 v21.62,44.72 21.43,44.53 21.43,28.4 19.82,26.79 19.82,26.75 19.55,26.48 19.55,25 18.77,24.22 18.77,22.82 15.42,19.47 v15.42,19.27
LED_BLUE  (via drill 0.3)
  Top 0.2: IC5.27 25.12,15.92 26.07,14.97 v26.17,14.97 | v43.17,28.22 43.17,28.97 R21.1
  Bottom 0.2: v26.17,14.97 26.82,14.32 31.86,14.32 33.35,15.81 33.35,17.08 36.88,20.61 38.84,20.61 40.24,22.01 40.24,24.06 43.17,26.99 43.17,27.17 43.17,27.26 v43.17,28.22
LED_GREEN  (via drill 0.3)
  Top 0.2: IC5.28 25.22,16.42 25.97,15.67 26.47,15.67 v27.12,15.02 | v42.42,27.47 43.57,27.47 44,27.9 44,28.66 44.31,28.97 R20.1
  Bottom 0.2: v27.12,15.02 27.07,15.02 27.32,14.77 31.68,14.77 32.92,16.01 32.92,17.31 36.62,21.01 38.67,21.01 39.84,22.18 39.84,24.23 42.02,26.41 42.02,27.07 v42.42,27.47 42.42,27.42
LED_RED  (via drill 0.3)
  Top 0.2: IC5.29 25.32,16.92 26.12,16.12 26.92,16.12 27.37,15.67 v27.87,15.67 | v41.32,26.72 41.32,28.97 R19.1
  Bottom 0.2: v27.87,15.67 28.32,15.22 31.52,15.22 32.47,16.17 32.47,17.58 41.32,26.43 v41.32,26.72 41.32,26.47
M_BAT  (via drill 0.3)
  Top 0.2: 16.32,19.42 | 16.32,19.42 15.77,19.97 v13.22,19.97 | 16.32,19.42 IC5.3 | R2.1 R12.2 18.59,31.5 v18.51,31.42
  Bottom 0.2: v13.22,19.97 13.26,20.01 13.9,20.01 14.78,20.87 15.02,20.87 17.57,23.42 17.57,30.26 17.57,30.48 v18.51,31.42
MISO  (via drill 0.3)
  Top 0.2: IC5.21 22.03,14.16 22.03,13.31 23.17,12.17 v23.67,12.17 24.02,11.82 26.66,11.82 30,15.16 30,16.4 v30.02,16.42 | IC6.2 25.88,4.02 25.02,4.87 v25.02,6.22
  Top 0.25: SD1.7 51.19,42.34 v51.17,42.32 | v51.17,42.32 51.19,42.26 51.15,42.32 v51.17,42.32
  Bottom 0.2: v25.02,6.22 25.6,6.8 25.6,8.76 25.52,8.87 24.15,10.24 24.15,11.71 23.69,12.17 v23.67,12.17 | v30.02,16.42 30.02,17.02 30.61,17.61 39.67,26.67 39.67,27.38 40.65,28.37 40.98,28.37 44.82,32.2 44.82,41.08 45.55,41.81 45.55,42.81 47.05,44.31 48.6,44.31 49.05,43.86 50.35,43.86 51.15,43.06 51.15,42.34 v51.17,42.32
MOSI  (via drill 0.3)
  Top 0.2: 21.51,11.66 21.52,11.6 21.52,12.67 21.03,13.11 21.03,14.16 IC5.19 | 21.51,11.66 21.55,11.62 | v18.87,6.62 18.99,6.6 IC6.5 | 21.51,11.66 21.57,11.57 v21.57,11.62 v21.57,11.61 22,11.16 22.25,10.91 27.05,10.91 31.35,15.21 31.35,15.36 31.72,15.73 v31.72,16.42
  Top 0.25: SD1.3 46.84,40.6 46.82,40.97 v46.82,42.37
  Bottom 0.2: v31.72,16.42 31.75,16.45 31.75,17.56 40.6,26.42 40.6,27.06 41.02,27.47 41.34,27.47 45.72,31.85 45.72,40.62 46.82,41.72 v46.82,42.37 | v21.57,11.62 21.57,7.02 21.17,6.62 v18.87,6.62
N$1
  Top 0.2: IC3.5 30.37,34.03 30.3,34.16 30.3,34.36 30.7,34.76 R5.2
N$2
  Top 0.203: R18.2 9.33,6.14 LED2.K
N$3
  Top 0.2: L3.2 38.82,25.12 | Q1.6 38.02,24.12
  Top 0.35: 38.02,24.12 37.45,24.12 Q1.TP1
  Top 0.4: 38.02,24.12 38.94,25.07 L3.2
  Top 0.406: Q1.TP1 Q1.TP2 36.9,22.85 36.69,22.63 36.21,22.63 Q1.3
N$4
  cutout VCC: 25.1,43.86 26.2,43.86 27.55,45.31 28.55,45.31 28.55,42.41 29.15,41.86 30.15,41.86 30.15,38.61 28.7,37.16 28.7,35.96 28.5,35.76 25.95,35.76 25.95,39.86 25.05,40.76
  cutout GND: 25.1,43.86 26.2,43.86 27.55,45.31 28.55,45.31 28.55,42.41 29.15,41.86 30.15,41.86 30.15,38.61 28.7,37.16 28.7,35.96 28.5,35.76 25.95,35.76 25.95,39.86 25.05,40.76
N$5
  cutout GND (no thermals): 15.85,38.06 15.85,39.31 16.3,39.76 17.2,39.76 17.85,39.11 21.35,39.11 21.95,38.51 21.95,36.91 21.6,36.51 16.75,36.51 15.9,37.36
  cutout VCC (no thermals): 15.85,38.06 15.85,39.31 16.3,39.76 17.2,39.76 17.85,39.11 21.35,39.11 21.95,38.51 21.95,36.91 21.6,36.51 16.75,36.51 15.9,37.36
N$7
  Top 0.2: 45.05,29.84 R20.2 45.05,30.41 45.6,30.96 45.6,32.26 44.75,33.11 LED1.2
N$8
  Top 0.2: 13.42,6.13 R4.2 13.42,6.14 LED3.K
N$9
  Top 0.2: TVS1.6 22.62,49.13 22.65,49.16 23.55,49.16 24.3,49.91 25.21,49.91 25.25,49.95 L1.1
  Top 0.254: USB.VBUS 24.19,51.95
  Top 0.406: L1.1 25.25,51.11 25.16,51.2 24.82,51.2 24.19,51.83 24.19,51.95 24.19,51.96
N$10
  Top 0.2: R19.2 41.47,29.97 41.67,30.17 42.31,30.17 42.7,30.56 42.7,32.81 42.4,33.11 LED1.1
N$11
  Top 0.2: R21.2 43.22,29.87 43.22,31.23 43.6,31.61 LED1.3
N$13
  Top 0.2: IC4.9 52.91,24.65 51.94,25.62 48.94,25.62 48.75,25.81 48.45,25.8 R3.1
N$15
  Top 0.61: L7.P$2 19.9,37.16 IC1.5 16.31,37.95 C21.2
N$17
  Top 0.2: IC2.22 26.44,43.07 27.2,42.31 28.15,42.31 28.5,41.96 28.5,41.51 28.8,41.21 29.86,41.21 C17.2 29.75,41.25 29.51,41.01 R10.2
N$19
  Top 0.2: IC2.23 27.07,43.57 27.52,44.02 27.77,44.02 | C13.2 28.07,43.23 28.05,43.56 28.05,43.74 27.77,44.02 | C12.2 28.07,44.79 28.05,44.36 28.05,44.3 27.77,44.02
N$32  (via drill 0.3)
  Top 0.2: IC2.11 21.06,42.07 20.55,41.56 v19.4,41.56 | v19.4,38.91 19.65,39.16 22.5,39.16 v22.65,39.01 | v31.1,39.01 30.95,39.01 30.65,39.31 30.65,39.46 R10.1 | R11.2 31.55,39.46 31.55,39.31 31.25,39.01 v31.1,39.01 | R1.2 31.77,38.34 31.6,38.51 31.6,38.71 31.3,39.01 v31.1,39.01
  Bottom 0.2: v19.4,41.56 19.65,41.31 19.65,39.16 v19.4,38.91 | v22.65,39.01 22.65,37.41 25.19,34.87 29.11,34.87 31.1,36.86 v31.1,39.01
N$33
  Top 0.2: R9.2 20.61,43.2 20.75,43.06 IC2.9
OTG  (via drill 0.3)
  Top 0.2: IC2.8 21.04,43.57 20.65,43.96 19.65,43.96 v19.2,44.41 | v19.5,46.21 19.5,46.76 19.4,46.86 Q2.3 19.4,49.52 R8.1
  Bottom 0.2: v19.2,44.41 19.5,44.71 v19.5,46.21
PA00_XIN32
  Top 0.2: IC5.1 16.57,20.42 15.57,21.47 15.57,22.93 15.19,23.31 Y1.P$2 15.19,23.79 15.18,23.78 14.5,24.46 14.5,25.04 C19.2
PA01_XOUT32
  Top 0.2: C20.2 11.87,22.41 12.3,22.41 13.03,21.68 13.03,21.65 Y1.P$1 13.59,21.65 13.99,21.24 14.01,21.22 15.12,21.22 16.42,19.92 IC5.2
PA30_SWCLK  (via drill 0.3)
  Top 0.2: v4.07,18.82 2.15,18.82 SWD.4 | v7.27,26.02 10.02,26.02 12.04,28.04 12.03,28.04 v12.45,28.46 | v15.05,29.76 15.55,29.76 16.2,29.11 16.2,28.36 18.82,25.74 18.82,24.28 18.82,22.97 19.52,22.27 19.52,21.42 19.53,21.26 IC5.45
  Bottom 0.2: v7.27,26.02 7.44,26.02 7.37,25.99 7.07,26.02 6.12,25.07 6.12,19.82 5.12,18.82 v4.07,18.82 | v12.45,28.46 13.75,28.46 v15.05,29.76
PA31_SWDIO  (via drill 0.3)
  Top 0.2: v4.07,17.57 2.17,17.57 SWD.2 | IC5.46 19.02,22.15 18.98,22.21 18.37,22.82 18.37,25.56 15.45,28.47 v15.45,28.81 | 12.91,27.57 v12.95,27.61 12.25,27.61 10.25,25.61 7.85,25.61 7.42,25.18 v7.42,25.02
  Bottom 0.2: v4.07,17.57 4.72,17.57 6.62,19.52 6.62,24.45 7.19,25.02 v7.42,25.02 | v12.95,27.61 13.35,28.01 14,28.01 14.8,28.81 v15.45,28.81
PSEL
  Top 0.25: IC2.2 24.4,44.87 24.4,45.91 25.35,46.85 R6.2
RESET  (via drill 0.3)
  Top 0.2: SWD.10 2.12,22.62 | IC4.5 53.07,16.23 49.7,12.86 45.9,12.86 v45.75,13.01 | v35.5,8.76 35.2,9.06 28.5,9.06 28.1,8.66 17.2,8.66 16.65,9.21 v16.35,9.21 | R15.2 2.61,14.37 v2.6,15.26 2.55,12.75 2.55,12.16 | R16.1 3.85,26.06 3.7,25.91 3.7,24.65 3.69,24.65 D1.+ 3.6,24.61 | 2.26,22.74 2.26,23.57 v2.6,23.91 2.6,24.41 2.8,24.61 3.6,24.61 | 3.6,24.61 3.67,24.61 | 2.55,12.16 2.25,11.86 P2.1 | 2.55,12.16 2.85,11.86 P2.2 v8.3,11.86
  Top 0.25: 2.26,22.74 SWD.10
  Bottom 0.2: v45.75,13.01 45.2,12.46 45.2,11.96 44.75,11.51 44.4,11.51 41.35,8.46 37.35,8.46 36.95,8.06 36.1,8.06 35.5,8.66 v35.5,8.76 | 3.5,14.21 v2.6,15.26 v2.6,23.91 | v16.35,9.21 16.35,9.56 14.75,11.16 10.7,11.16 10,11.86 v8.3,11.86
RX_PMS
  Top 0.25: IC5.48 18.02,21.59 17.4,22.21 17.4,25.11 13.3,29.21 11.25,29.21 10.15,30.31 10.15,31.96 10.15,32.16 9.2,33.11 9.2,34.06 8.95,34.31 8.95,42.56 8.57,42.94 7.36,42.94 CONN_DATA.11
RXWIFI
  Top 0.2: IC5.10 15.56,15.92 15.2,15.56 15.2,15.01 15.95,14.26 15.95,13.61 16.35,13.21 16.35,12.01 17.2,11.16 17.55,11.16 18.25,10.46 27.25,10.46 27.65,10.86 38.8,10.86 39.2,11.26 41.6,11.26 41.85,11.01 41.85,8.51 41.6,8.26 40.4,8.26 IC4.22 40.35,8.21
SCK  (via drill 0.3)
  Top 0.2: v22.62,11.62 22.6,11.91 22.37,12.14 22.37,12.37 21.53,13.23 21.53,14.16 IC5.20 | 22.66,11.67 | 22.66,11.67 22.95,11.66 23.1,11.66 23.4,11.36 26.85,11.36 30.85,15.36 30.85,15.9 v30.87,15.92 | 19.97,5.28 v19.07,5.27 | 22.66,11.67 v22.62,11.62 | 22.62,11.56 v22.62,11.62
  Top 0.25: SD1.5 48.99,41.12 48.98,42.12 49.12,42.52 v49.02,42.32
  Top 0.406: 19.97,5.28 20.49,5.28 IC6.6
  Bottom 0.2: v30.87,15.92 30.87,17.26 40.12,26.51 40.12,27.22 40.82,27.92 41.16,27.92 45.27,31.98 45.27,40.83 46,41.56 46,42.61 46.01,42.62 47.24,43.84 48.32,43.84 49,43.16 v49.02,42.32 | v19.07,5.27 19.87,6.12 21.34,6.12 21.39,6.18 22.02,6.82 22.02,11.08 22.55,11.61 v22.62,11.62
SCL  (via drill 0.3)
  Top 0.2: IC2.5 22.9,44.86 22.95,44.91 22.9,44.96 22.9,45.76 22.91,45.9 v22.91,46.12 | IC5.32 | 4.32,35.44 v4.37,35.42 4.31,35.42 CONN_DATA.4
  Top 0.25: IC5.32 26.75,18.42 27.83,19.5 27.83,22.96 25.86,24.93 R14.1 25,27.96 v24.95,28.01
  VCC 0.25: v24.95,28.01 24.3,27.36 21.09,27.36 17.75,30.7 17.75,32.7 v17.97,32.92 16.12,32.92 15.68,32.48 14.63,32.48 13.4,33.71 5.35,33.71 4.37,34.69 v4.37,35.42
  Bottom 0.2: v22.91,46.12 22.5,46.51 22.25,46.51 22,46.76 21.3,46.76 21.05,46.51 20.82,46.51 19.9,45.59 19.9,44.06 20.1,43.86 20.1,42.39 20.11,42.38 20.11,33.57 19.46,32.92 v17.97,32.92
SCL_GROOVE  (via drill 0.3)
  Top 0.2: IC5.26 25.02,15.42 25.47,14.97 25.47,14.72 26.12,14.07 v26.12,13.37 | R22.1 49.55,35.86 49.75,35.66 50.35,35.66 50.58,35.43 50.93,35.43 | 50.93,35.43 X1.1 | 50.93,35.43 51.76,35.43 51.95,35.62 v52.87,35.62
  Bottom 0.2: v52.87,35.62 50.77,35.62 44.32,29.17 44.32,26.85 41.04,23.57 41.04,21.68 39.17,19.81 37.36,19.81 34.25,16.7 34.25,15.41 32.26,13.42 26.17,13.42 v26.12,13.37
SDA  (via drill 0.3)
  Top 0.2: IC2.6 22.42,45.6 21.96,46.06 v21.65,46.06 | IC5.31 | v3.22,35.42 1.75,35.42 1.75,35.4 CONN_DATA.6
  Top 0.25: IC5.31 26.98,17.92 28.36,19.3 28.36,23.16 26.66,24.86 | 26.66,24.86 26.65,24.87 | 26.66,24.86 R13.1 v26.66,26.91 v26.65,26.91
  VCC 0.25: v26.65,26.91 20.9,26.91 16.92,30.89 v16.92,31.87 10.28,31.87 8.88,33.26 4.7,33.26 3.22,34.74 v3.22,35.42
  Bottom 0.2: v21.65,46.06 21,46.06 20.35,45.41 20.35,44.26 20.53,44.08 20.53,33.43 19.27,32.16 17.21,32.16 v16.92,31.87
SDA_GROOVE  (via drill 0.3)
  Top 0.2: IC5.25 24.92,14.92 25.07,14.77 25.07,14.37 25.32,14.12 v25.32,13.87 | R23.1 48.17,37.17 48.66,36.68 48.66,34.09 49.13,33.62 X1.2 v54.36,33.62
  Bottom 0.2: v54.36,33.62 49.37,33.62 44.72,28.97 44.72,28.01 | 44.72,28.01 44.72,26.87 | v25.32,13.87 25.32,13.17 25.82,12.67 26.47,12.67 26.77,12.97 32.46,12.97 34.7,15.21 34.7,16.5 37.61,19.41 39.33,19.41 41.44,21.52 41.44,23.41 44.72,26.69 44.72,28.01 | 44.72,28.01
SW
  Top 0.2: IC2.19 IC2.20 | 27.61,39.79 L2.1 | C14.2 27.74,40.71 27.65,40.61 27.3,40.26 26.75,40.41
  pour Top (isolate 0.4, no thermals): 26.17,42.07 25.32,42.07 25.27,42.02 25.27,41.57 25.57,41.22 25.57,40.77 27.1,39.21 27.1,38.71 27.07,36.02 28.57,36.02 28.56,38.21 28.56,39.23 28.07,39.72 28.02,39.72 27.12,40.62 27.12,41.12
SW_GROOVE  (via drill 0.3)
  Top 0.2: IC5.38 23.02,21.77 24.12,22.87 v24.57,22.87 | Q3.2 42.5,39.66 42.53,39.68 42.49,39.68 42.5,39.68 42.5,39.63 42.45,39.67 v42.47,39.67 | 42.52,36.83 Q3.5 42.5,37.29 42.5,36.76 41.95,36.21 41.25,36.21 41.06,36.02 v40.97,36.02 40.79,36.2 R29.2
  Bottom 0.2: v42.47,39.67 41,38.25 41,36.05 v40.97,36.02 41.65,35.24 41.65,35.11 41.67,35.07 41.68,33.75 41.68,31.03 40.37,29.72 40.23,29.72 38.32,27.81 38.32,27.12 31.76,20.56 26.85,20.56 24.57,22.84 v24.57,22.87 v24.57,22.86
SW_PMS  (via drill 0.3)
  Top 0.2: IC5.11 16.26,15.42 v16,15.16 | v11.65,30.56 11.15,31.06 11.15,34.01 12.36,35.22 R27.2 13.09,35.26 IC1.3
  Bottom 0.2: v16,15.16 16,14.31 15.5,13.81 11.7,13.81 9.3,16.21 9.3,22.86 10.4,23.96 10.4,26.01 10.25,26.16 10.25,27.16 9.95,27.46 9.95,29.46 10.4,29.91 10.45,29.91 11.1,30.56 v11.65,30.56
SW_WIFI  (via drill 0.3)
  Top 0.2: IC5.37 23.52,21.57 24.12,22.17 24.89,22.17 25.47,22.75 v25.57,22.87 | Q1.2 35.21,23.31 R28.1 34.88,23.41 33.7,23.41 33.59,23.42 v33.57,23.42 | Q1.5 39.13,23.32 v39.19,23.38
  VCC 0.2: v39.19,23.38 33.61,23.38 v33.57,23.42
  Bottom 0.2: v25.57,22.87 25.57,22.49 27.05,21.01 31.55,21.01 33.55,23.01 v33.57,23.42
TARGET_RESET  (via drill 0.3)
  Top 0.2: v13.55,18.06 11.35,18.06 8.2,14.91 6.45,14.91 6.25,14.72 C3.2 R15.1 | v22.25,22.61 22.25,22.21 22.05,22.01 22.05,21.2 IC5.40
  Bottom 0.2: v13.55,18.06 15.35,18.06 16.15,18.86 16.15,19.56 19.2,22.61 v22.25,22.61
TARGET_USB_N  (via drill 0.3)
  Top 0.2: TVS1.2 22.05,50.46 v22.3,50.71 | v24.05,50.71 24.05,50.96 23.52,51.49 USB.D- | 25.99,24.16 25.51,24.64
  Top 0.25: IC5.33 26.55,18.92 27.29,19.66 27.29,22.86 25.99,24.16 | v16.1,34.11 16.1,31.61 17.8,29.91
  Top 0.254: 17.8,29.91 19.92,29.91 20.34,29.49 23.1,29.49 24.27,28.31 24.27,27.73 25.4,26.6 25.4,24.75 25.51,24.64 27.29,22.86
  VCC 0.2: v22.3,50.71 22.38,50.79 23.97,50.79 v24.05,50.71
  VCC 0.25: v24.05,50.71 24.14,50.62 24.14,49.76 22.69,48.31 18.98,48.31 14.7,44.03 14.7,34.5 15.09,34.11 v16.1,34.11
TARGET_USB_P  (via drill 0.3)
  Top 0.2: v23.35,50.06 23.35,50.66 22.86,51.15 USB.D+ | v23.35,50.06 23.15,49.86 TVS1.1 23.16,49.87 v23.35,50.06
  Top 0.25: 26.74,22.65 26.74,22.44 26.74,19.83 26.33,19.42 IC5.34 | v15.4,33.16 15.4,31.41 17.2,29.61
  Top 0.254: 17.2,29.61 17.5,29.31 19.87,29.31 20.15,29.04 22.84,29.04 23.82,28.06 23.82,27.54 24.95,26.41 24.95,24.56 26.74,22.77 26.74,22.44
  VCC 0.25: v23.35,50.06 22.1,48.81 18.75,48.81 14.15,44.21 14.15,34.02 15.01,33.16 v15.4,33.16
TX_PMS
  Top 0.25: IC5.47 18.52,21.84 17.9,22.46 17.9,25.31 13.5,29.66 13.45,29.71 11.5,29.71 10.7,30.51 10.7,32.46 9.7,33.46 9.7,34.31 9.45,34.56 9.45,44.96 8.93,45.48 7.36,45.48 CONN_DATA.13
TXLED  (via drill 0.3)
  Top 0.2: IC5.39 22.52,21.88 23.15,22.51 v23.15,22.82 | v13.12,15.12 13.4,14.84 13.4,14.41 14.15,13.66 14.15,13.01 14.55,12.61 14.55,11.31 14.25,11.01 14.25,8.61 14.05,8.4 13.41,7.76 13.05,7.76 12.35,7.06 R18.1
  Bottom 0.2: v23.15,22.82 22.9,22.57 22.9,22.34 21.08,20.52 20,20.52 14.6,15.12 v13.12,15.12
TXWIFI
  Top 0.2: IC4.21 40.36,10.22 | IC5.9 15.46,16.42 14.75,15.71 14.75,14.86 15.5,14.11 15.5,13.46 15.9,13.06 15.9,11.81 17.7,10.01 27.45,10.01 27.85,10.41 39.85,10.41 40.03,10.23 IC4.21 | 40.19,10.41 IC4.21
USB_ID  (via drill 0.3)
  Top 0.2: v21.3,50.41 21.45,50.21 21.55,50.16 21.54,50.15 TVS1.3 21.54,50.88 22.2,51.54 USB.ID | 24.4,48.11 v24.4,48.31 24.2,48.1 R26.1 | 23.5,48.12 R26.1 | R26.1 23.45,48.11 23.2,47.86 23.2,47.46 22.95,47.22 R7.2 22.05,47.21 21.75,46.91 Q2.2
  Bottom 0.2: v21.3,50.41 21.3,50.36 21.7,49.96 22.4,49.96 23,49.36 23.35,49.36 v24.4,48.31
V+1
  pour Top (no thermals): 24.87,51.17 24.87,49.52 24.92,49.47 25.62,49.47 25.82,49.67 25.82,50.77 25.42,51.17
VBAT  (via drill 0.3)
  Top 0.2: 22.15,40.11 22.32,40.29 | 22.32,40.29 22.42,40.38 IC2.13 | IC2.14 22.92,40.23 22.75,40.06 22.5,40.11 22.32,40.29
  Top 0.5: 13.99,46.32 13.99,46.27
  Top 1.016: C28.2 13.99,42.76 13.99,47.07
  other vias: 22.1,40.21
  pour Top (no thermals): 13.25,46.61 13.55,46.91 14.5,46.91 14.9,46.51 14.95,43.91 15.7,43.16 18.25,43.16 18.7,42.71 18.7,41.41 19.1,41.01 22.75,41.01 22.8,40.91 22.8,40.66 22.4,40.66 22.25,40.46 22,40.31 22.1,40.21 22.4,40.21 22.5,40.46 22.75,40.46 22.75,40.05 22.36,39.66 18,39.66 17.05,40.61 17.05,41.16 16.55,41.66 14.03,41.66 13.25,42.44
VCC  (via drill 0.3, 0.35)
  Top 0.2: IC5.44 20.02,22.44 19.55,22.91 v19.55,23.31 C24.2 | v22.17,2.77 21.14,2.77 21,2.77 IC6.8 C2.2 | IC5.17 20.02,12.53 C23.2 19.7,12.2 19.7,11.81 v19.45,11.56 | v5.97,16.47 6.01,16.51 SWD.1 6.04,17.56 7.5,17.56 7.85,17.91 7.85,23.31 7.5,23.66 6.25,23.66 5.91,24 5.91,24.47 D1.- 5.95,24.56 5.95,25.86 5.75,26.06 R16.2 | R17.2 v37.05,50.76 | IC5.36 24.4,20.42 v24.4,21.36 24.4,21.41 C25.2 | 31.55,24.61 31.48,24.69 | R28.2 35.15,24.12 | R26.2 v23.85,46.61 | R8.2 v17.95,49.56 18.25,49.26 R30.2 | R25.2 46.15,39.61 47.6,39.61 47.9,39.91 SD1.4 | R24.2 v29.55,7.11 | C9.2 35.55,27.41 35.4,27.26 | F2.1 30.97,24.88 31.12,25.04 | v14.44,3.29 14.42,3.27 LED3.A | v8.28,3.28 LED2.A
  Top 0.25: v11.07,16.42 11.41,16.02 L5.1 | R13.2 v27.55,25.06 | R14.2 v27.65,27.96
  Top 0.4: SD1.4 47.89,42.2 v47.87,42.32 v47.87,43.12 | F2.1 31.07,24.71 | 35.4,27.26 35.45,27.26 | v37.85,33.21 36.3,33.21 36.36,33.22 F1.2 v33.51,33.22 v33.5,33.21 | C9.2 36,27.41 35.75,26.81 | 31.85,24.31 31.48,24.69 31.12,25.04 30.95,25.21
  Top 0.406: 21,2.77 | F2.1 33.68,24.88 34.44,24.12 R28.2 35.99,24.12 36.06,24.11 Q1.1
  Top 0.5: v39.97,31.62 LED1.4
  Top 0.8: F2.1 30.9,26.26 31.25,26.61 32.9,26.61 33.7,27.41
  Top 1: 35.4,27.26 35.25,27.41 v33.85,27.41
  VCC 0.2: v19.55,23.31 19.85,23.31 | v37.05,50.76 37.45,50.76 | v24.4,21.36 24.4,21.66 | v23.85,46.61 23.85,46.41 | v17.95,49.56 17.95,49.61 17.8,49.61 | v29.55,7.11 29.55,7.41
  VCC 0.4: v37.85,33.21 38.15,33.21 | v33.5,33.21 33.5,33.51
  other vias: 1.52,28.12 3.12,28.12 29.6,23.26 30.9,23.26 32.2,23.26 38.8,22.41 38.4,21.66
  pour Top (no thermals): 0.77,30.37 0.77,27.87 1.77,26.87 4.77,26.87 5.52,27.62 5.52,28.62 6.27,29.37 8.02,29.37 8.27,29.62 8.27,30.37 8.02,30.62 5.27,30.62 5.02,30.37 3.77,30.37 3.52,30.62 1.02,30.62
  pour VCC (rank 2, no thermals): -0.33,56.57 -0.33,-0.53 58.27,-0.53 58.32,56.52
  pour Top (isolate 0.25, no thermals): 29.25,24.01 29.25,23.13 29.47,22.91 32.28,22.91 32.5,23.13 32.5,24.01
  pour Top: 37.9,22.61 37.9,21.81 38.35,21.31 38.85,21.31 39.25,21.71 39.25,22.66 39.2,22.71 38,22.71
VCC_GROOVE  (via drill 0.3)
  Top 0.2: Q3.3 42.05,38.95 Q3.TP2 | Q3.TP1 43.17,38.03 Q3.6 | R22.2 R23.2 47.19,38.05 46.25,37.11 45.85,37.11 45.5,36.76
  Top 0.5: Q3.TP2 Q3.TP1
  other vias: 48.67,31.62 47.95,31.19 55.23,32.04 54.28,32.04 55.23,31.14 54.28,31.14 49.47,32.49
  pour Top (isolate 0.4, no thermals): 47.52,31.12 47.52,32.33 47.52,32.34 55.37,32.34 55.53,32.18 55.53,30.94 55.44,30.84 47.8,30.84
  pour VCC (no thermals): 48.32,32.12 48.57,32.37 53.79,32.37 53.93,32.24 53.93,30.99 53.81,30.87 48.52,30.87 48.27,31.12
  pour Top (isolate 0.254): 46.67,34.14 46.67,32.55 48.54,30.86 49.94,30.85 50.25,31.16 50.25,32.08 48.56,33.78 48.55,34.66 44.55,38.56 43.2,38.56 43.2,36.76 43.25,36.71 44.1,36.71
VCC_GROOVE_0
  pour Top (isolate 0.3): 34.05,39.76 34.05,36.71 34.5,36.26 37.9,36.26 38.4,36.76 41.95,36.76 41.95,37.31 41.85,37.41 41.6,37.41 41.4,37.61 41.4,38.86 41.55,39.01 43.9,39.01 43.95,39.06 43.95,39.81 42.95,40.81 41.55,40.81 40.85,40.11 34.4,40.11
VCC_SOURCE
  Top 0.4: IC3.1 29.35,31.4 29.4,31.35 29.4,30.76 30.33,29.83 30.33,28.98 F2.2 31.43,28.78 31.45,28.76 31.45,29.86 30.3,31.01 30.3,31.4 | 30.3,31.4 IC3.2 30.3,31.4
VCC_WIFI  (via drill 0.3)
  Top 0.2: 40.46,25.11 L3.1
  Top 0.25: IC4.17 40.36,18.22 39.12,18.22 38.77,18.57 C1.2 | R3.2 v47.21,25.32 v47.2,25.31
  Top 0.35: v42.12,18.27 40.41,18.27 IC4.17 | v55.37,23.92 IC4.8 | IC4.1 53.53,8.23 v51.72,10.07
  Top 0.4: 40.46,25.11 41.5,25.11 42.2,25.81 R3.2
  VCC 0.35: v51.72,10.07 51.92,10.07
  pour VCC: 52.27,9.17 52.38,9.17 55.98,12.74 55.98,24.05 54.45,25.58 47.04,25.58 41.67,20.2 41.67,17.86 50.36,9.17
VDDCORE
  Top 0.2: IC5.43 20.52,23.53 20.97,23.98 20.97,24.06 20.97,24.16 | 20.97,24.16 20.97,24.34 | 20.97,24.34 20.97,24.45 | 20.97,24.34 21.14,24.34 C26.2 20.97,24.16
VSYS
  Top 0.2: 29.32,34.07 IC3.6 | R5.1 29.84,35.19
  Top 0.406: R5.1 29.8,35.78 C10.2
  pour Top (no thermals): 23.42,41.07 23.42,40.22 23.34,40.14 23.34,38.74 23.87,38.72 23.92,38.72 23.94,38.79 23.94,39.7 23.92,39.77 23.92,41.07
  pour Top (isolate 0.3, no thermals): 23.35,38.96 22.95,38.96 22.4,38.41 22.4,36.96 21.45,36.01 17.45,36.01 16.6,35.16 16.6,34.31 17.6,33.31 19.85,33.31 20.5,32.66 22.25,32.66 22.35,32.76 22.35,33.61 22.55,33.81 25.7,33.81 26.3,33.21 27.75,33.21 28.45,33.91 29.45,33.91 29.5,33.96 29.5,34.21 30,34.71 30,35.41 26.8,35.41 26.25,35.96 25.55,35.96 25.65,39.11 24.4,39.11 23.95,39.56
VUSB
  pour Top (isolate 0.25): 25.3,44.06 24.88,44.48 24.88,45.88 25.11,46.11 25.9,46.11 26.2,46.41 26.2,49.11 26.6,49.51 26.6,51.05 27.41,51.86 29.12,51.86 30.1,50.88 30.1,50.07 30.81,49.36 31.05,49.36 31.44,48.97 31.44,47.46 30.87,46.89 29.73,46.89 29.21,47.4 27.53,47.4 27.2,47.07 27.2,44.59 26.67,44.06
WIFI_LED  (via drill 0.3)
  Top 0.2: IC4.19 39.42,14.22 39.43,14.23 39.54,14.23 v38.77,14.22 | v36.52,8.77 36.49,8.77 36.49,8.7 35.8,8.01 35.15,8.01 34.55,8.61 28.7,8.61 28.25,8.16 14.55,8.16 R4.1
  Bottom 0.2: v38.77,14.22 37.82,13.27 37.82,11.07 37.8,10.56 36.52,9.28 v36.52,8.77